# EAGLE design LaunchPadSpiBus2 (EAGLE 6.4)
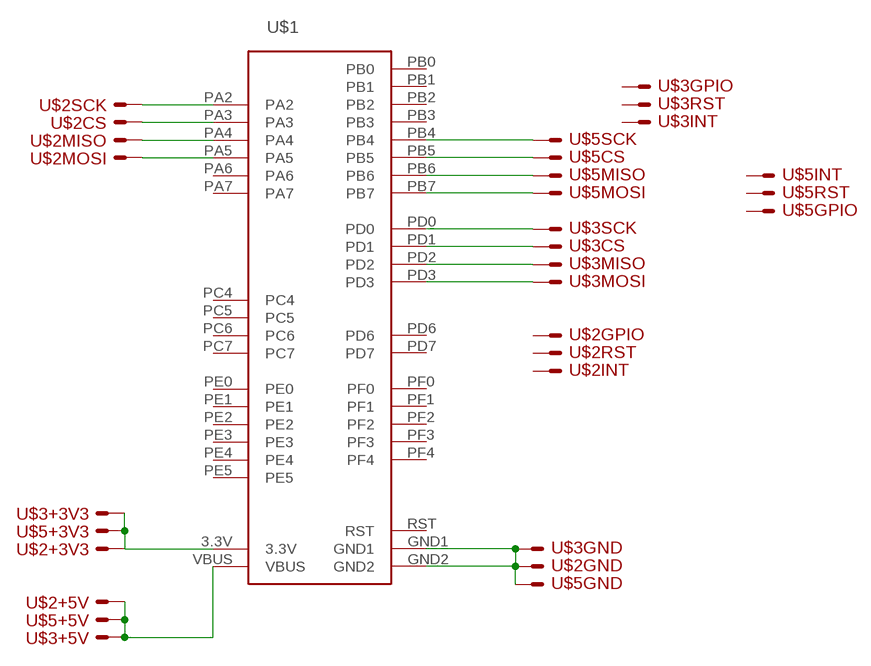
[diagram p0: schematic, sheet 1]

## Parts
U$1  STELLARIS-LAUNCHPADSTELLARIS-LAUNCHPAD-XL  [LAUNCHPAD-XL]
U$2  SPI_BUS  [SPI_BUS]
U$3  SPI_BUS  [SPI_BUS]
U$5  SPI_BUS  [SPI_BUS]

## Nets
N$1: U$1.PA3 U$2.CS
N$5: U$1.PD0 U$3.SCK
N$6: U$1.PD1 U$3.CS
N$7: U$1.VBUS U$2.+5V U$3.+5V U$5.+5V
N$8: U$1.PA2 U$2.SCK
N$9: U$1.GND1 U$1.GND2 U$2.GND U$3.GND U$5.GND
N$10: U$1.3.3V U$2.+3V3 U$3.+3V3 U$5.+3V3
N$11: U$1.PB5 U$5.CS
N$12: U$1.PA5 U$2.MOSI
N$14: U$1.PB4 U$5.SCK
N$15: U$1.PB7 U$5.MOSI
N$16: U$1.PB6 U$5.MISO
N$17: U$1.PA4 U$2.MISO
N$21: U$1.PD2 U$3.MISO
N$22: U$1.PD3 U$3.MOSI
Unconnected: U$1.PA6 U$1.PA7 U$1.PB0 U$1.PB1 U$1.PB2 U$1.PB3 U$1.PC4 U$1.PC5 U$1.PC6 U$1.PC7 U$1.PD6 U$1.PD7 U$1.PE0 U$1.PE1 U$1.PE2 U$1.PE3 U$1.PE4 U$1.PE5 U$1.PF0 U$1.PF1 U$1.PF2 U$1.PF3 U$1.PF4 U$2.GPIO U$2.INT U$2.RST U$3.GPIO U$3.INT U$3.RST U$5.GPIO U$5.INT U$5.RST

## Power pins joined to a net without a drawn wire
RST: U$1.RST

## Library data of the parts
U$1 = StellarisLaunchPad_Fred:STELLARIS-LAUNCHPAD
U$2 U$3 U$5 = lieven:SPI_BUS

## Board
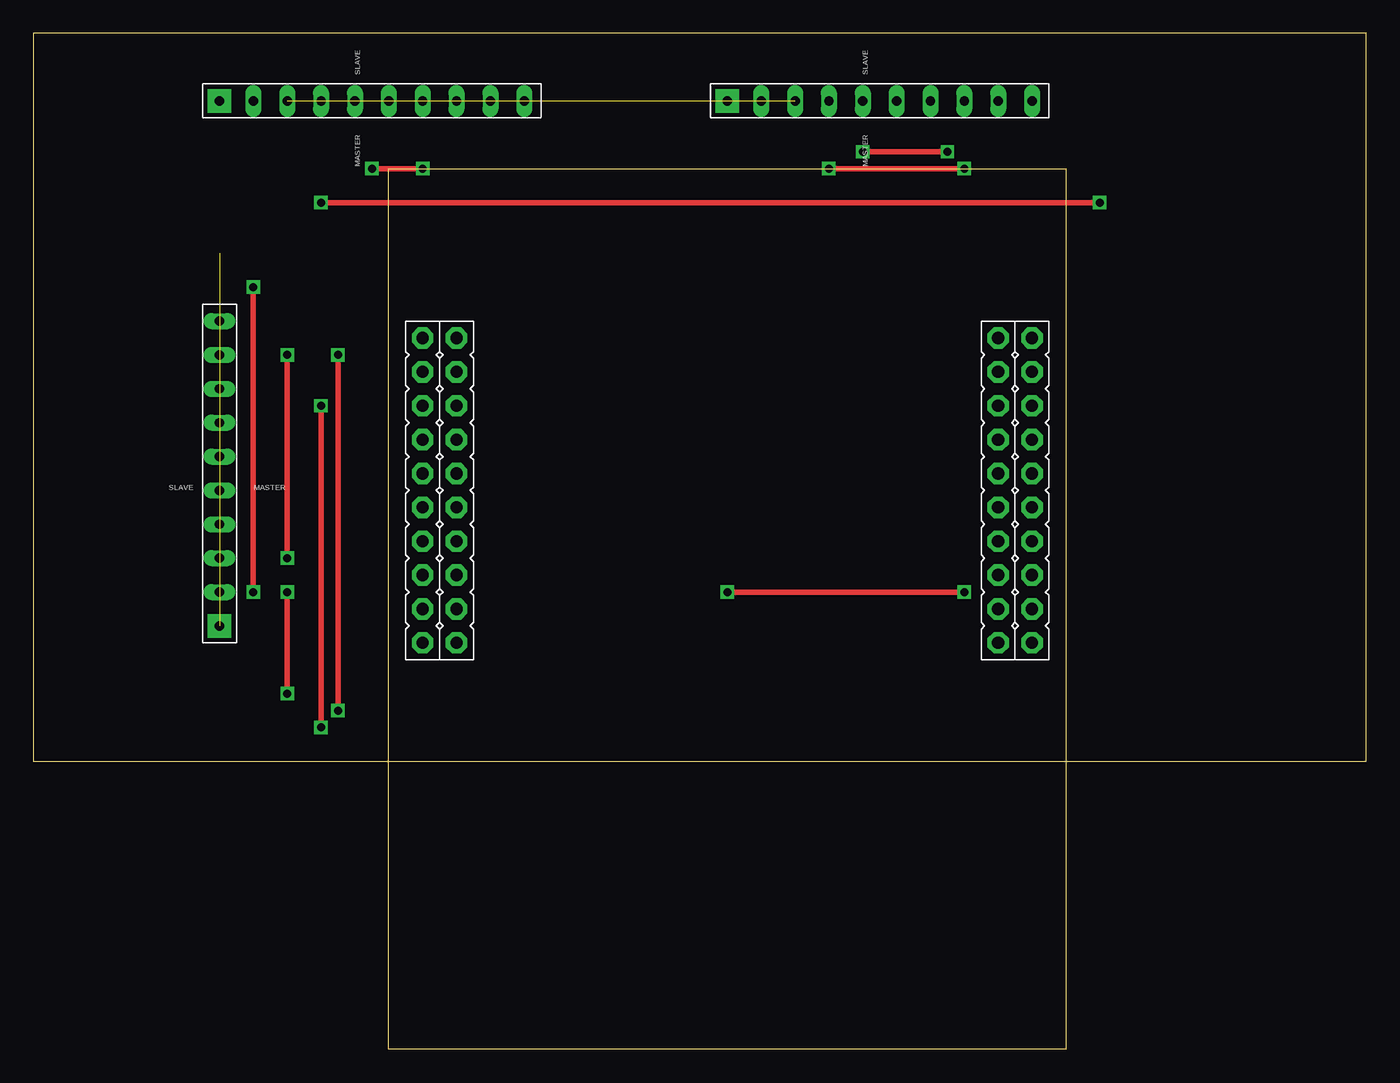
[diagram p1: board, top side]
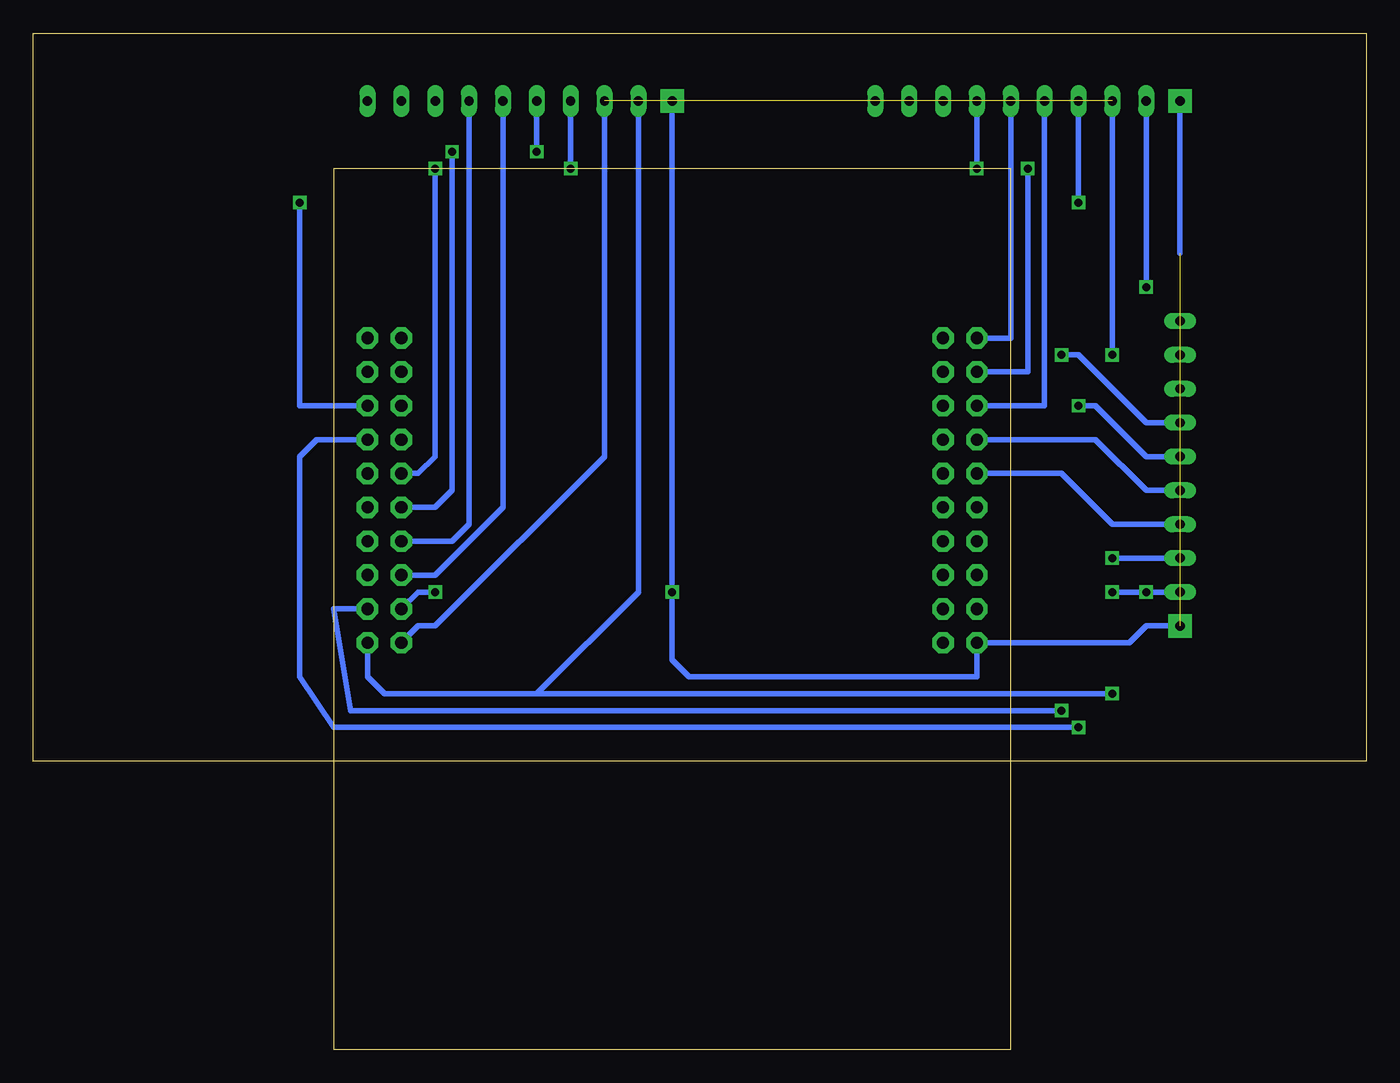
[diagram p2: board, bottom side, seen from below]

Size 100 x 54.6 mm. Coordinates in mm from the lower left corner, seen from the top.
Outline: 0,0 100,0 100,54.6 0,54.6 0,0
Copper layers (1*16): Top 0.035mm / dielectric 1.5mm / Bottom 0.035mm
Design rules "default": minimum track width 10mil, minimum drill 24mil, track to track 8mil, track to pad 8mil, pad to pad 8mil, via to via 8mil, smd to smd 8mil, copper to edge 40mil, drill to drill 8mil, minimum pad ring 10mil, minimum via ring 8mil, stop-mask expansion 4mil, vias tented up to drill 0mil, thermal gap 10mil

### Footprints (pad centres in the part's own frame; a part is rotated, then mirrored left to right if it is on the bottom)
LAUNCHPAD-XL = drill 0.914 pad 1.6 octagon: 3.3V 30.48,2.54; GND1 33.02,5.08; GND2 30.48,48.26; PA2 53.34,48.26; PA3 50.8,48.26; PA4 48.26,48.26; PA5 48.26,2.54; PA6 50.8,2.54; PA7 53.34,2.54; PB0 35.56,2.54; PB1 38.1,2.54; PB2 33.02,48.26; PB3 35.56,45.72; PB4 45.72,2.54; PB5 33.02,2.54; PB6 45.72,48.26; PB7 43.18,48.26; PC4 38.1,45.72; PC5 40.64,45.72; PC6 43.18,45.72; PC7 45.72,45.72; PD0 35.56,5.08; PD1 38.1,5.08; PD2 40.64,5.08; PD3 43.18,5.08; PD6 48.26,45.72; PD7 50.8,45.72; PE0 35.56,48.26; PE1 45.72,5.08; PE2 48.26,5.08; PE3 50.8,5.08; PE4 40.64,2.54; PE5 43.18,2.54; PF0 38.1,48.26; PF1 53.34,5.08; PF2 30.48,45.72; PF3 33.02,45.72; PF4 53.34,45.72; RST 40.64,48.26; VBUS 30.48,5.08
SPI_BUS = drill 0.7 long: +3V3 0,2.54; +5V 0,5.08; CS 0,15.24; GPIO 0,22.86; INT 0,17.78; MISO 0,10.16; MOSI 0,7.62; RST 0,20.32; SCK 0,12.7 | drill 0.7 pad 1.778 square: GND 0,0

### Placement (x,y rotation side)
U$1  77.47,-21.59 90 top
U$2  13.97,49.53 270 top
U$3  52.07,49.53 270 top
U$5  13.97,10.16 0 top

### Tracks (layer width: path | path; a pad name or v marks a point on that pad's centre or on a via)
N$1  (via drill 0.6)
  Top 0.406: v25.4,44.45 v29.21,44.45
  Bottom 0.406: U$1.PA3 25.4,29.21 v25.4,44.45 | v29.21,44.45 U$2.CS
N$5
  Bottom 0.406: U$3.SCK 64.77,19.05 69.85,13.97 U$1.PD0
N$6
  Bottom 0.406: U$3.CS 67.31,17.78 68.58,16.51 U$1.PD1
N$7  (via drill 0.6)  (1 unrouted)
  Top 0.406: v19.05,30.48 v19.05,15.24
  Bottom 0.406: U$3.+5V 57.15,22.86 69.85,10.16 71.12,10.16 U$1.VBUS | U$2.+5V v19.05,30.48 | v19.05,15.24 U$5.+5V
N$8
  Bottom 0.406: U$2.SCK 26.67,31.75 U$1.PA2
N$9  (via drill 0.6)  (1 unrouted)
  Top 0.406: v52.07,12.7 v69.85,12.7
  Bottom 0.406: U$3.GND v52.07,12.7 52.07,7.62 50.8,6.35 29.21,6.35 U$1.GND2 17.78,8.89 16.51,10.16 U$5.GND | v69.85,12.7 71.12,12.7 U$1.GND1 | U$2.GND 13.97,38.1
N$10  (via drill 0.6)
  Top 0.406: v19.05,12.7 v19.05,5.08 | v16.51,35.56 v16.51,12.7
  Bottom 0.406: U$3.+3V3 54.61,12.7 62.23,5.08 | 62.23,5.08 73.66,5.08 74.93,6.35 U$1.3.3V | U$5.+3V3 v16.51,12.7 17.78,12.7 v19.05,12.7 | v19.05,5.08 62.23,5.08 | U$2.+3V3 v16.51,35.56
N$11  (via drill 0.6)
  Top 0.406: v22.86,30.48 v22.86,3.81
  Bottom 0.406: U$5.CS 16.51,25.4 21.59,30.48 v22.86,30.48 | v22.86,3.81 76.2,3.81 77.47,11.43 U$1.PB5
N$12  (via drill 0.6)
  Top 0.406: v21.59,41.91 v80.01,41.91
  Bottom 0.406: U$2.MOSI v21.59,41.91 | v80.01,41.91 80.01,26.67 U$1.PA5
N$14  (via drill 0.6)
  Top 0.406: v21.59,26.67 v21.59,2.54
  Bottom 0.406: U$5.SCK 16.51,22.86 20.32,26.67 v21.59,26.67 | v21.59,2.54 77.47,2.54 80.01,6.35 80.01,22.86 78.74,24.13 U$1.PB4
N$15
  Bottom 0.406: U$5.MOSI 19.05,17.78 22.86,21.59 U$1.PB7
N$16
  Bottom 0.406: U$5.MISO 16.51,20.32 20.32,24.13 U$1.PB6
N$17
  Bottom 0.406: U$2.MISO 24.13,26.67 U$1.PA4
N$21  (via drill 0.6)
  Top 0.406: v62.23,45.72 v68.58,45.72
  Bottom 0.406: U$3.MISO v62.23,45.72 | v68.58,45.72 68.58,20.32 69.85,19.05 U$1.PD2
N$22  (via drill 0.6)
  Top 0.406: v59.69,44.45 v69.85,44.45
  Bottom 0.406: U$3.MOSI v59.69,44.45 | v69.85,44.45 69.85,22.86 71.12,21.59 U$1.PD3